# EAGLE design uCBoardBase (EAGLE 6.4)

## Sheet 1 of 2
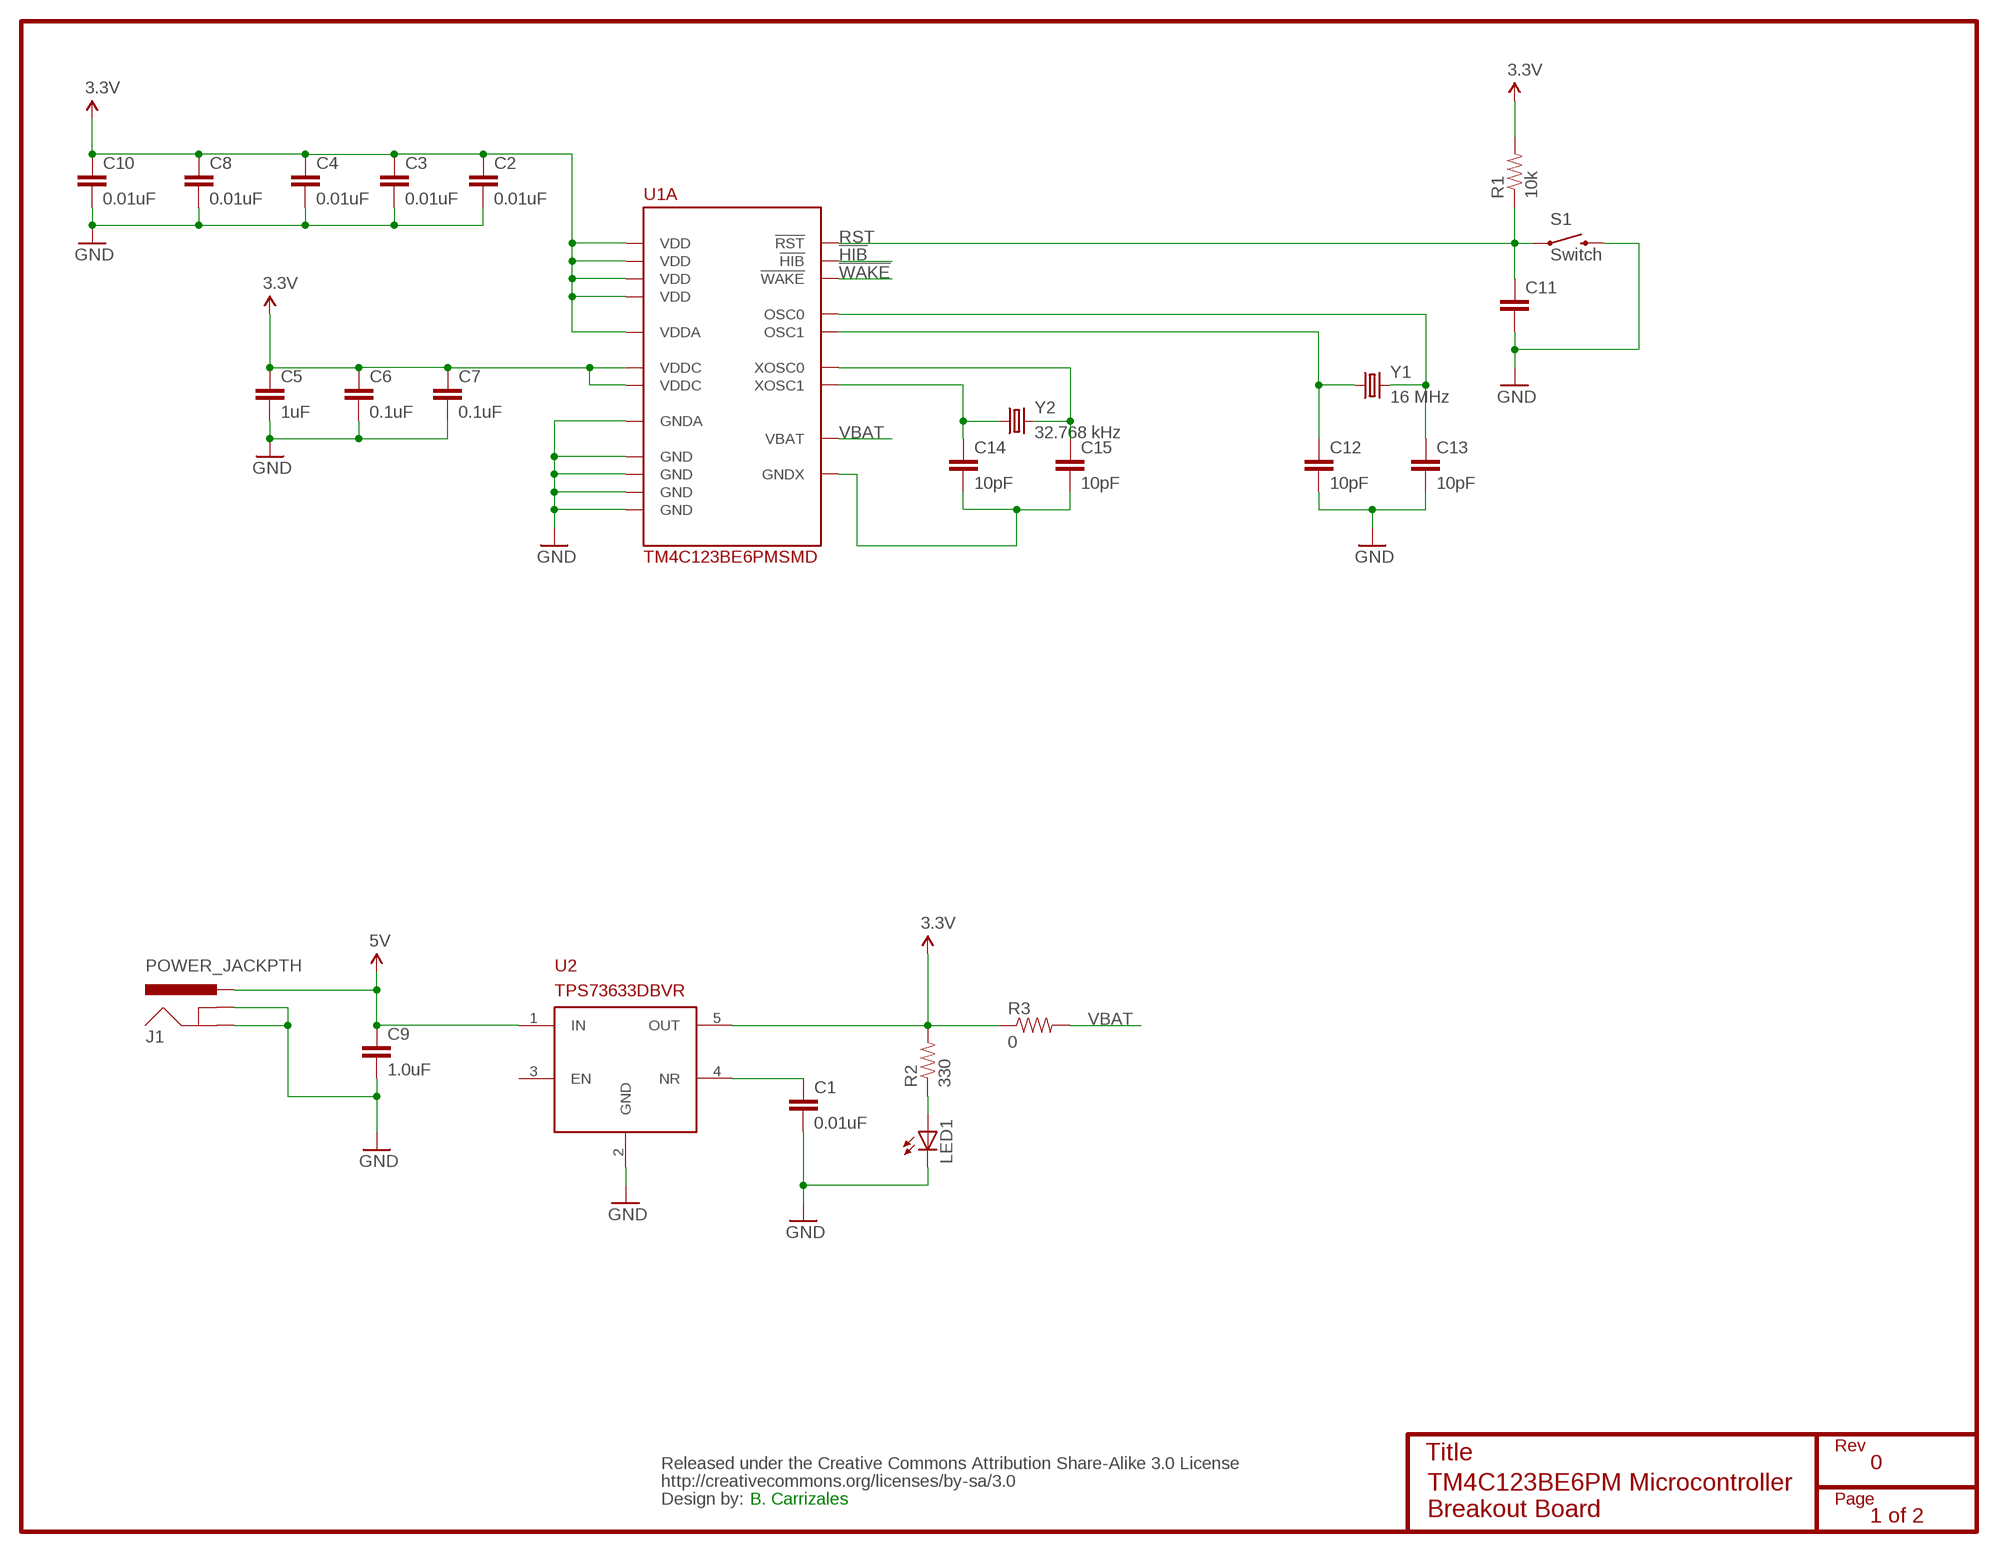
[diagram p0: schematic, sheet 1]

### Parts
C1  0.01uF  CAP0603-CAP  [0603-CAP]
C2  0.01uF  CAP0603-CAP  [0603-CAP]
C3  0.01uF  CAP0603-CAP  [0603-CAP]
C4  0.01uF  CAP0603-CAP  [0603-CAP]
C5  1uF  CAP0603-CAP  [0603-CAP]
C6  0.1uF  CAP0603-CAP  [0603-CAP]
C7  0.1uF  CAP0603-CAP  [0603-CAP]
C8  0.01uF  CAP0603-CAP  [0603-CAP]
C9  1.0uF  CAP0603-CAP  [0603-CAP]
C10  0.01uF  CAP0603-CAP  [0603-CAP]
C11  CAP0603-CAP  [0603-CAP]
C12  10pF  CAP0603-CAP  [0603-CAP]
C13  10pF  CAP0603-CAP  [0603-CAP]
C14  10pF  CAP0603-CAP  [0603-CAP]
C15  10pF  CAP0603-CAP  [0603-CAP]
CC_TEXT1  CREATIVE_COMMONS  [CREATIVE_COMMONS]
J1  POWER_JACKPTH  [POWER_JACK_PTH]
LED1  LED1206  [LED-1206]
R1  10k  RESISTOR0603-RES  [0603-RES]
R2  330  RESISTOR0603-RES  [0603-RES]
R3  0  RESISTOR0603-RES  [0603-RES]
S1  Switch  SWITCH-MOMENTARY-2-SMD-1101NE  [TACTILE-SWITCH-1101NE]
U1  TM4C123BE6PMSMD  [64LQFP]
U2  TPS73633DBVR  [SOT23-DBV]
Y1  16 MHz  CRYSTALHC49US  [HC49US]
Y2  32.768 kHz  CRYSTALTC26H  [TC26H]

### Nets
3.3V: C2.1 C3.1 C4.1 C5.1 C6.1 C7.1 C8.1 C10.1 R1.2 R2.2 R3.1 U1.2(A:VDDA) U1.11(A:VDD) U1.25(A:VDDC) U1.26(A:VDD) U1.42(A:VDD) U1.54(A:VDD) U1.56(A:VDDC) U2.5(OUT) ; also sheet 2
5V: C9.1 J1.PWR U2.1(IN) ; also sheet 2
!HIB: U1.33(A:!HIB) ; also sheet 2
!WAKE: U1.32(A:!WAKE) ; also sheet 2
GND: C1.2 C2.2 C3.2 C4.2 C5.2 C6.2 C7.2 C8.2 C9.2 C10.2 C11.2 C12.2 C13.2 J1.GND J1.GNDBREAK LED1.C S1.P$2 U1.3(A:GNDA) U1.12(A:GND) U1.27(A:GND) U1.39(A:GND) U1.55(A:GND) U2.2(GND) ; also sheet 2
N$2: C13.1 U1.40(A:OSC0) Y1.2
N$3: C12.1 U1.41(A:OSC1) Y1.1
N$6: C1.1 U2.4(NR)
N$8: LED1.A R2.1
N$9: C14.1 U1.36(A:XOSC1) Y2.1
N$10: C15.1 U1.34(A:XOSC0) Y2.2
N$11: C14.2 C15.2 U1.35(A:GNDX)
RST: C11.1 R1.1 S1.P$1 U1.38(A:!RST) ; also sheet 2
VBAT: R3.2 U1.37(A:VBAT) ; also sheet 2
Unconnected: U2.3(EN)

### Notes on the sheet
- 0
- B. Carrizales
- TM4C123BE6PM Microcontroller
  Breakout Board
- 1 of 2

## Sheet 2 of 2
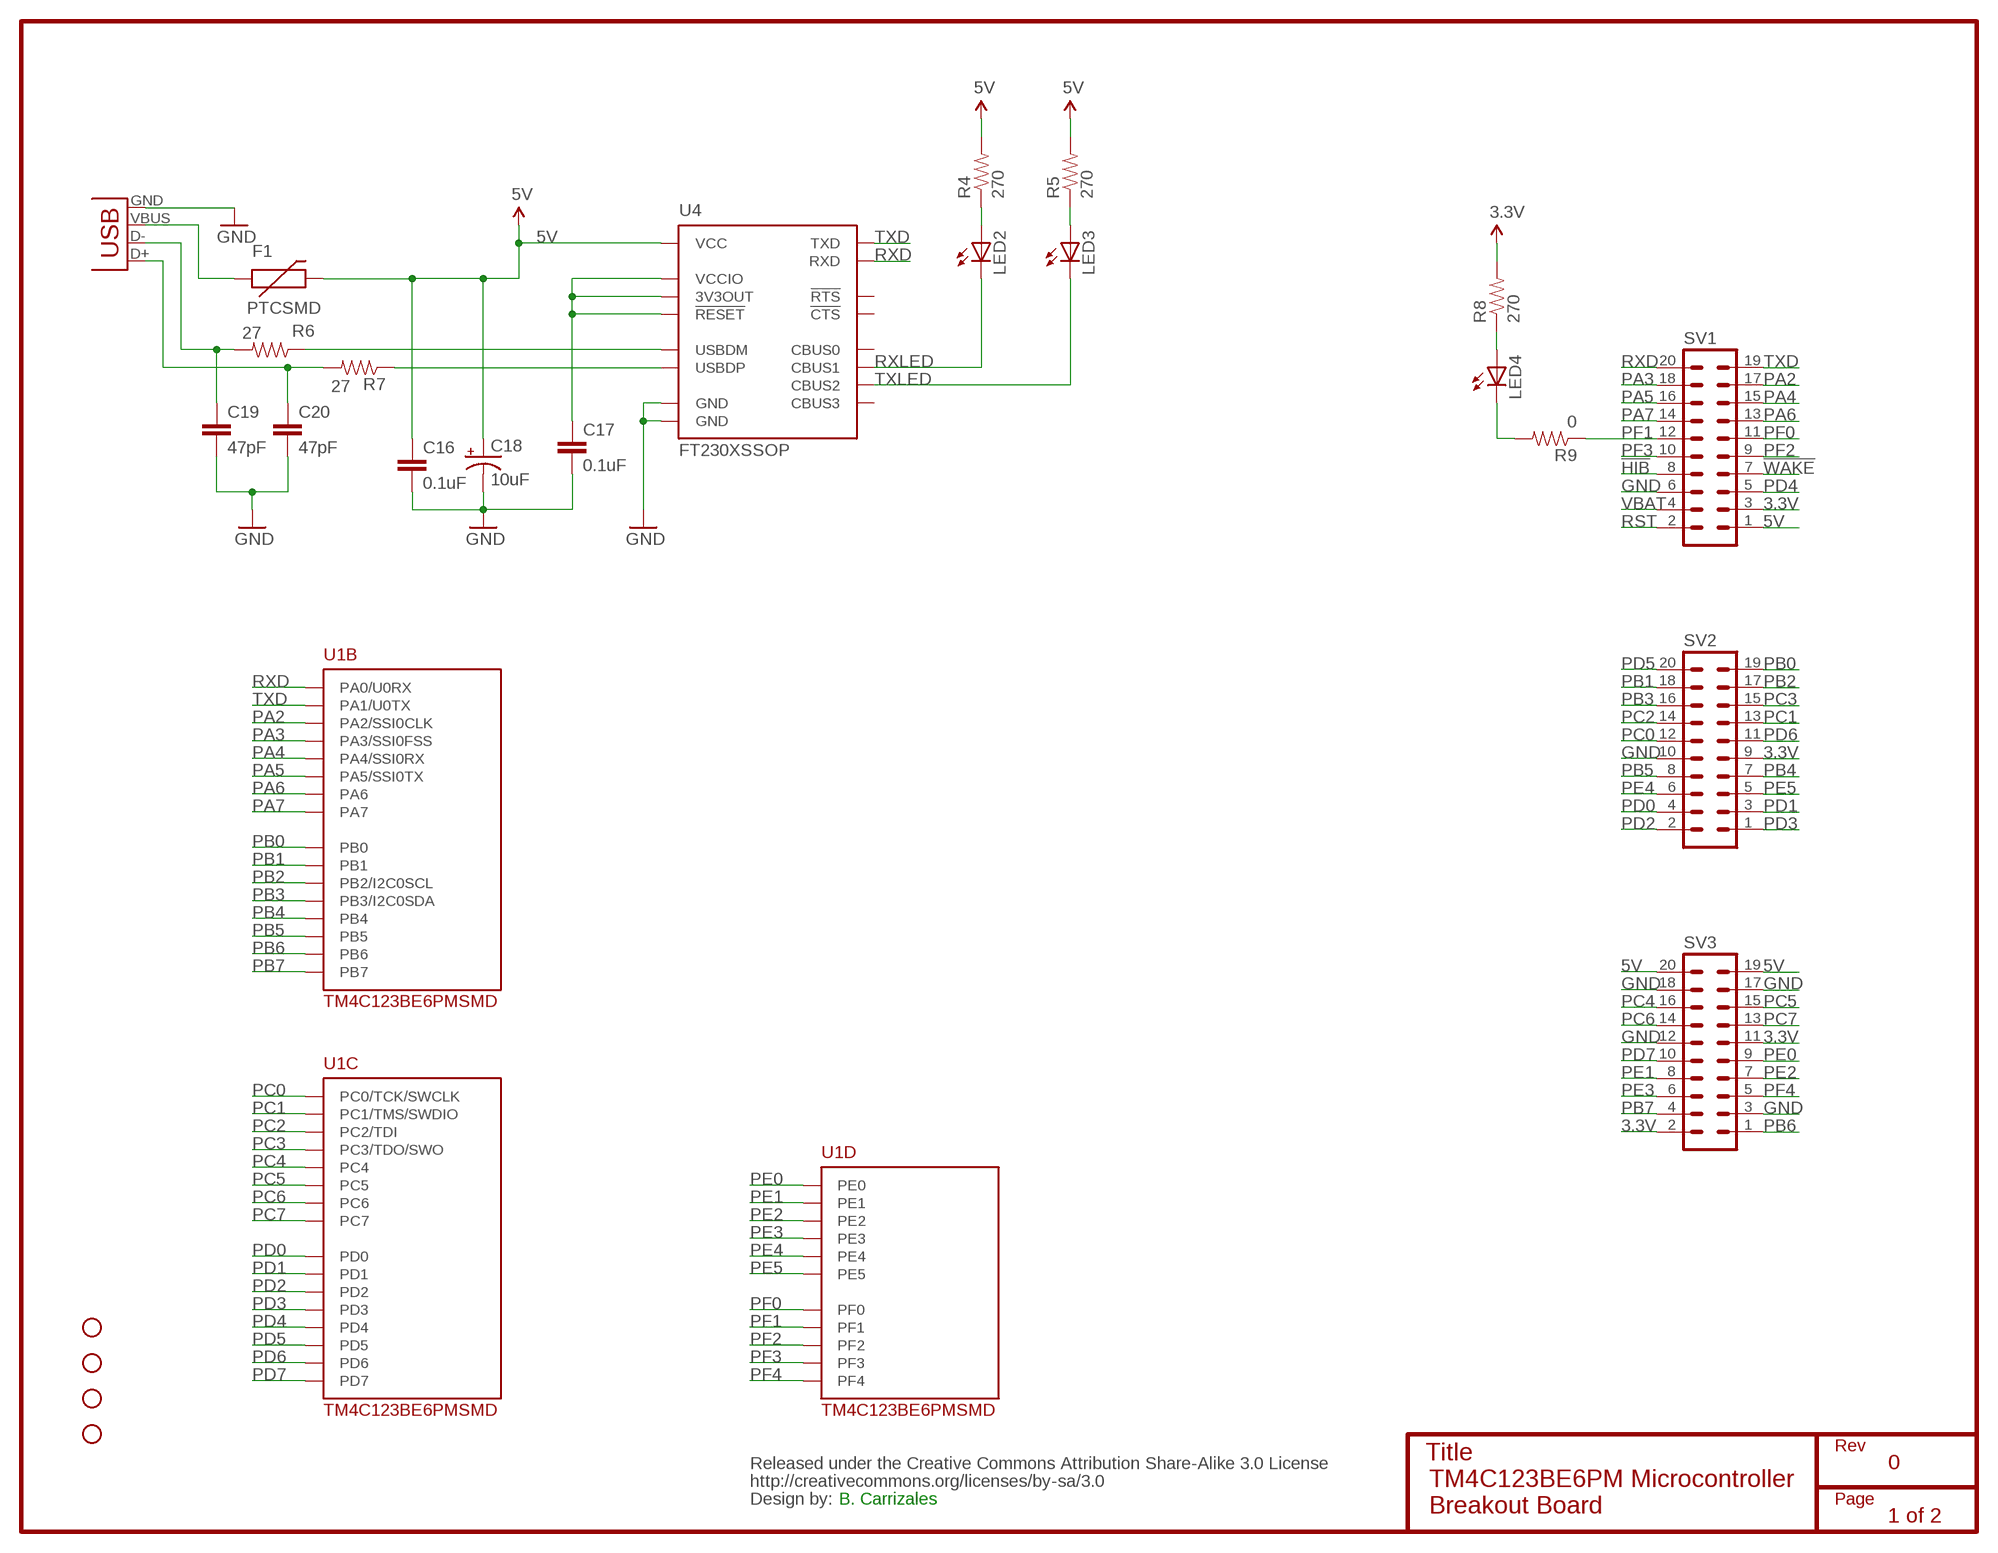
[diagram p1: schematic, sheet 2]

### Parts
C16  0.1uF  CAP0603-CAP  [0603-CAP]
C17  0.1uF  CAP0603-CAP  [0603-CAP]
C18  10uF  CAP_POL1206-KIT  [EIA3216-KIT]
C19  47pF  CAP0603-CAP  [0603-CAP]
C20  47pF  CAP0603-CAP  [0603-CAP]
CC_TEXT2  CREATIVE_COMMONS  [CREATIVE_COMMONS]
F1  PTCSMD  [PTC-1206]
JP2  USBSMD  [USB-MINIB]
LED2  LED0603  [LED-0603]
LED3  LED0603  [LED-0603]
LED4  LED0603  [LED-0603]
R4  270  RESISTOR0603-RES  [0603-RES]
R5  270  RESISTOR0603-RES  [0603-RES]
R6  27  RESISTOR0603-RES  [0603-RES]
R7  27  RESISTOR0603-RES  [0603-RES]
R8  270  RESISTOR0603-RES  [0603-RES]
R9  0  RESISTOR0603-RES  [0603-RES]
STANDOFF1  STAND-OFF  [STAND-OFF]
STANDOFF2  STAND-OFF  [STAND-OFF]
STANDOFF3  STAND-OFF  [STAND-OFF]
STANDOFF4  STAND-OFF  [STAND-OFF]
SV1  MA10-2  [MA10-2]
SV2  MA10-2  [MA10-2]
SV3  MA10-2  [MA10-2]
U4  FT230XSSOP  [SSOP16]

### Nets
3.3V: R8.2 SV1.3 SV2.9 SV3.2 SV3.11 ; also sheet 1
5V: C16.1 C18.A(+) F1.2 R4.2 R5.2 SV1.1 SV3.19 SV3.20 U4.12(VCC) ; also sheet 1
!HIB: SV1.8 ; also sheet 1
!WAKE: SV1.7 ; also sheet 1
GND: C16.2 C17.2 C18.C(-) C19.2 C20.2 JP2.GND SV1.6 SV2.10 SV3.3 SV3.12 SV3.17 SV3.18 U4.5(GND) U4.13(GND) ; also sheet 1
N$1: LED4.A R8.1
N$4: C19.1 JP2.D- R6.2
N$7: C20.1 JP2.D+ R7.2
N$12: LED3.A R5.1
N$13: LED2.A R4.1
N$14: F1.1 JP2.VBUS
N$15: R7.1 U4.8(USBDP)
N$16: R6.1 U4.9(USBDM)
N$17: C17.1 U4.3(VCCIO) U4.10(3V3OUT) U4.11(!RESET)
PA2: SV1.17 U1.19(B:PA2/SSI0CLK)
PA3: SV1.18 U1.20(B:PA3/SSI0FSS)
PA4: SV1.15 U1.21(B:PA4/SSI0RX)
PA5: SV1.16 U1.22(B:PA5/SSI0TX)
PA6: SV1.13 U1.23(B:PA6)
PA7: SV1.14 U1.24(B:PA7)
PB0: SV2.19 U1.45(B:PB0)
PB1: SV2.18 U1.46(B:PB1)
PB2: SV2.17 U1.47(B:PB2/I2C0SCL)
PB3: SV2.16 U1.48(B:PB3/I2C0SDA)
PB4: SV2.7 U1.58(B:PB4)
PB5: SV2.8 U1.57(B:PB5)
PB6: SV3.1 U1.1(B:PB6)
PB7: SV3.4 U1.4(B:PB7)
PC0: SV2.12 U1.52(C:PC0/TCK/SWCLK)
PC1: SV2.13 U1.51(C:PC1/TMS/SWDIO)
PC2: SV2.14 U1.50(C:PC2/TDI)
PC3: SV2.15 U1.49(C:PC3/TDO/SWO)
PC4: SV3.16 U1.16(C:PC4)
PC5: SV3.15 U1.15(C:PC5)
PC6: SV3.14 U1.14(C:PC6)
PC7: SV3.13 U1.13(C:PC7)
PD0: SV2.4 U1.61(C:PD0)
PD1: SV2.3 U1.62(C:PD1)
PD2: SV2.2 U1.63(C:PD2)
PD3: SV2.1 U1.64(C:PD3)
PD4: SV1.5 U1.43(C:PD4)
PD5: SV2.20 U1.44(C:PD5)
PD6: SV2.11 U1.53(C:PD6)
PD7: SV3.10 U1.10(C:PD7)
PE0: SV3.9 U1.9(D:PE0)
PE1: SV3.8 U1.8(D:PE1)
PE2: SV3.7 U1.7(D:PE2)
PE3: SV3.6 U1.6(D:PE3)
PE4: SV2.6 U1.59(D:PE4)
PE5: SV2.5 U1.60(D:PE5)
PF0: SV1.11 U1.28(D:PF0)
PF1: R9.1 SV1.12 U1.29(D:PF1)
PF2: SV1.9 U1.30(D:PF2)
PF3: SV1.10 U1.31(D:PF3)
PF4: SV3.5 U1.5(D:PF4)
RST: SV1.2 ; also sheet 1
RXD: SV1.20 U1.17(B:PA0/U0RX) U4.4(RXD)
RXLED: LED2.C U4.14(CBUS1)
TXD: SV1.19 U1.18(B:PA1/U0TX) U4.1(TXD)
TXLED: LED3.C U4.7(CBUS2)
TXLED1: LED4.C R9.2
VBAT: SV1.4 ; also sheet 1
Unconnected: U4.2(!RTS) U4.6(!CTS) U4.15(CBUS0) U4.16(CBUS3)

### Notes on the sheet
- 0
- B. Carrizales
- TM4C123BE6PM Microcontroller
  Breakout Board
- 1 of 2

## Library data of the parts
C1-C17 C19 C20 = SparkFun-Passives:CAP: Capacitor Standard 0603 ceramic capacitor, and 0.1" leaded capacitor.
C18 = SparkFun-Passives:CAP_POL: Capacitor Polarized These are standard SMD and PTH capacitors. Normally 10uF, 47uF, and 100uF in electrolytic and tantalum varieties. Always verify the external diameter of the through hole cap, it varies with capacity, voltage, and manufacturer. The EIA devices should be standard.
CC_TEXT1 CC_TEXT2 = SparkFun-Aesthetics:CREATIVE_COMMONS: Creative Commons License summary
F1 = SparkFun-PowerIC:PTC: Resettable Fuse PTC Resettable Fuse. Spark Fun Electronics SKU : COM-08357
J1 = SparkFun-Connectors:POWER_JACK: Power Jack This is the standard 5.5mm barrel jack for power. The PTH is the most common, proven, reliable, footprint. The Slot footprint only works if the mill layer is transmitted to the PCB fab house so be warned. Spark Fun Electronics SKU : PRT-00119 SMT: CONN-08106 Mating wall wart : TOL-00298 (and others)
JP2 = SparkFun-Connectors:USB: USB Connectors USB-B-PTH is fully proven SKU : PRT-00139/CONN-08278 USB-miniB is fully proven SKU : PRT-00587 USB-A-PCB is untested. USB-A-H is throughly reviewed, but untested. Spark Fun Electronics SKU : PRT-00437 USB-B-SMT is throughly reviewed, but untested. Needs silkscreen touching up. USB-A-S has not been used/tested USB-MB-H has not been used/tested USB-MICROB has been used. CONN-09505
LED1-LED4 = SparkFun-LED:LED: LEDs Standard schematic elements and footprints for 5mm, 3mm, 1206, and 0603 sized LEDs. 5mm - Spark Fun Electronics SKU : COM-00529 (and others)
R1-R9 = SparkFun-Passives:RESISTOR: Resistor Basic schematic elements and footprints for 0603, 1206, and PTH resistors.
S1 = SparkFun-Electromechanical:SWITCH-MOMENTARY-2: Various NO switches- pushbuttons, reed, etc
STANDOFF1-STANDOFF4 = SparkFun-Electromechanical:STAND-OFF: #4 Stand Off This is the mechanical footprint for a #4 phillips button head screw. Use the keepout ring to avoid running the screw head into surrounding components. SKU : PRT-00447
SV1-SV3 = con-lstb:MA10-2: PIN HEADER; OC_FARNELL: unknown; OC_NEWARK: unknown
U1 = microcontrollers-ti:TM4C123BE6PM: TM4C123BE6PM is a cortex-M microcontroller made by Texas Instruments; DIGIKEYPART#: 296-35834-ND
U2 = regulators:TPS73633DBVR; DIGIKEY#: 296-27064-1-ND
U4 = SparkFun-DigitalIC:FT230X: The FT230X is a simple USB to serial converter IC. The CBUS lines can be used as TX and RX activity LEDs, RS485 Tx data enable, and device sleep control.
Y1 Y2 = SparkFun-FreqCtrl:CRYSTAL: Various standard crystals. Proven footprints. Spark Fun Electronics SKU : COM-00534

## Board
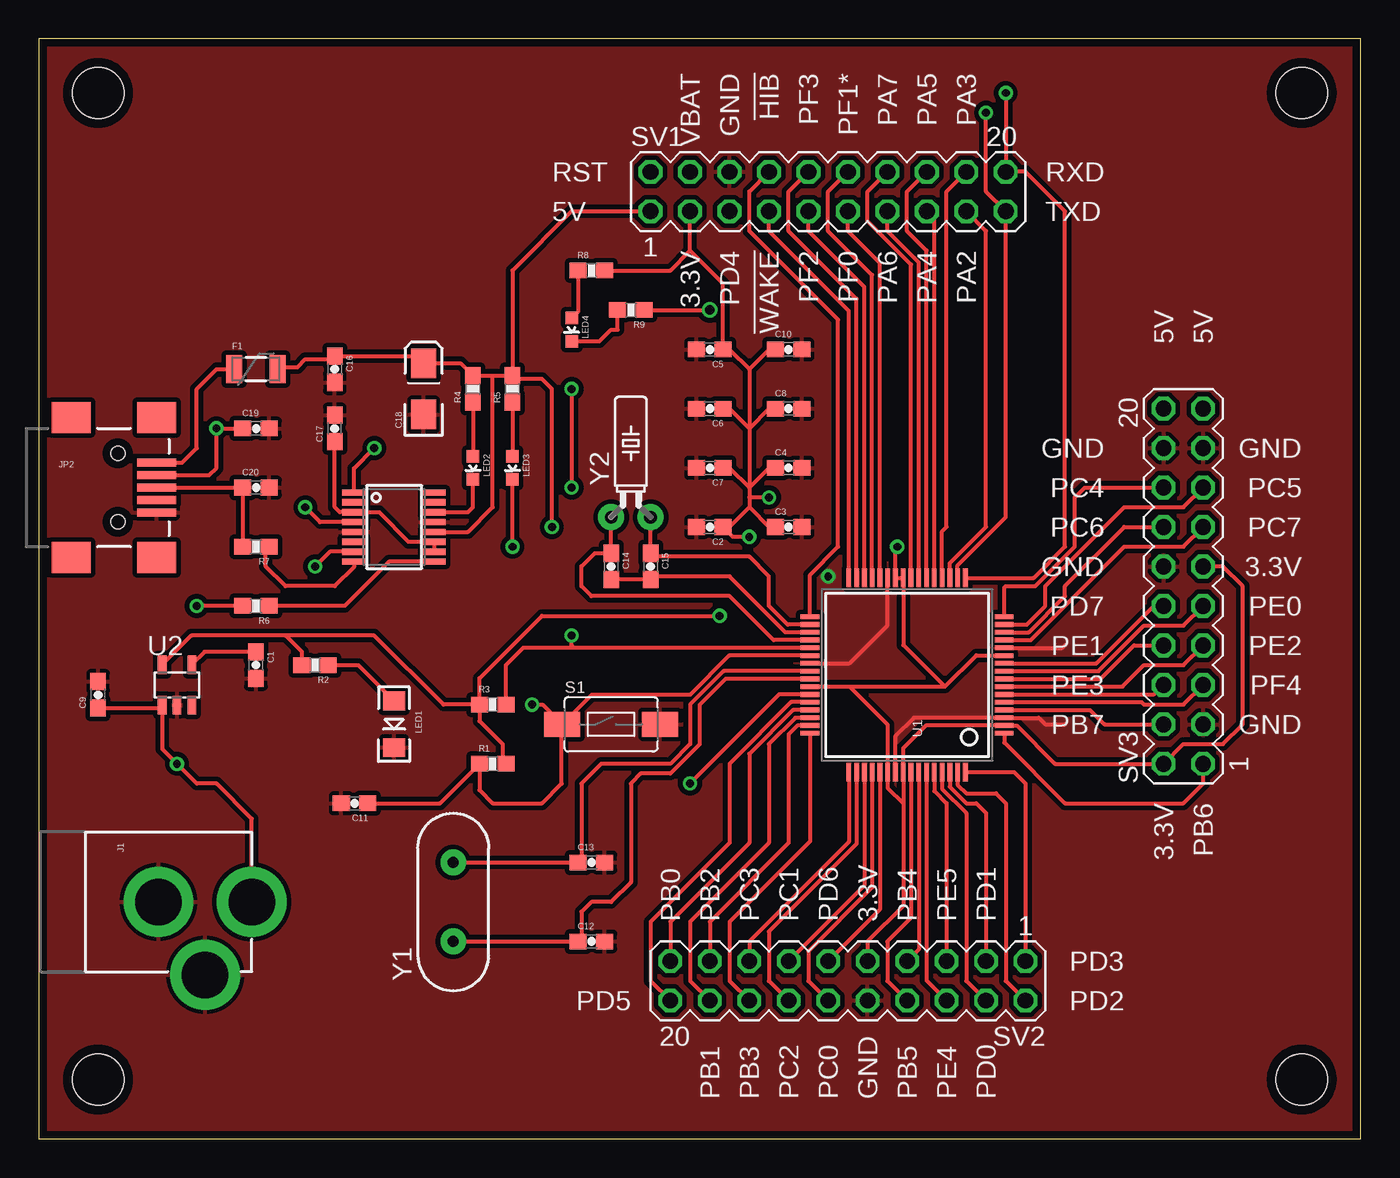
[diagram p2: board, top side]
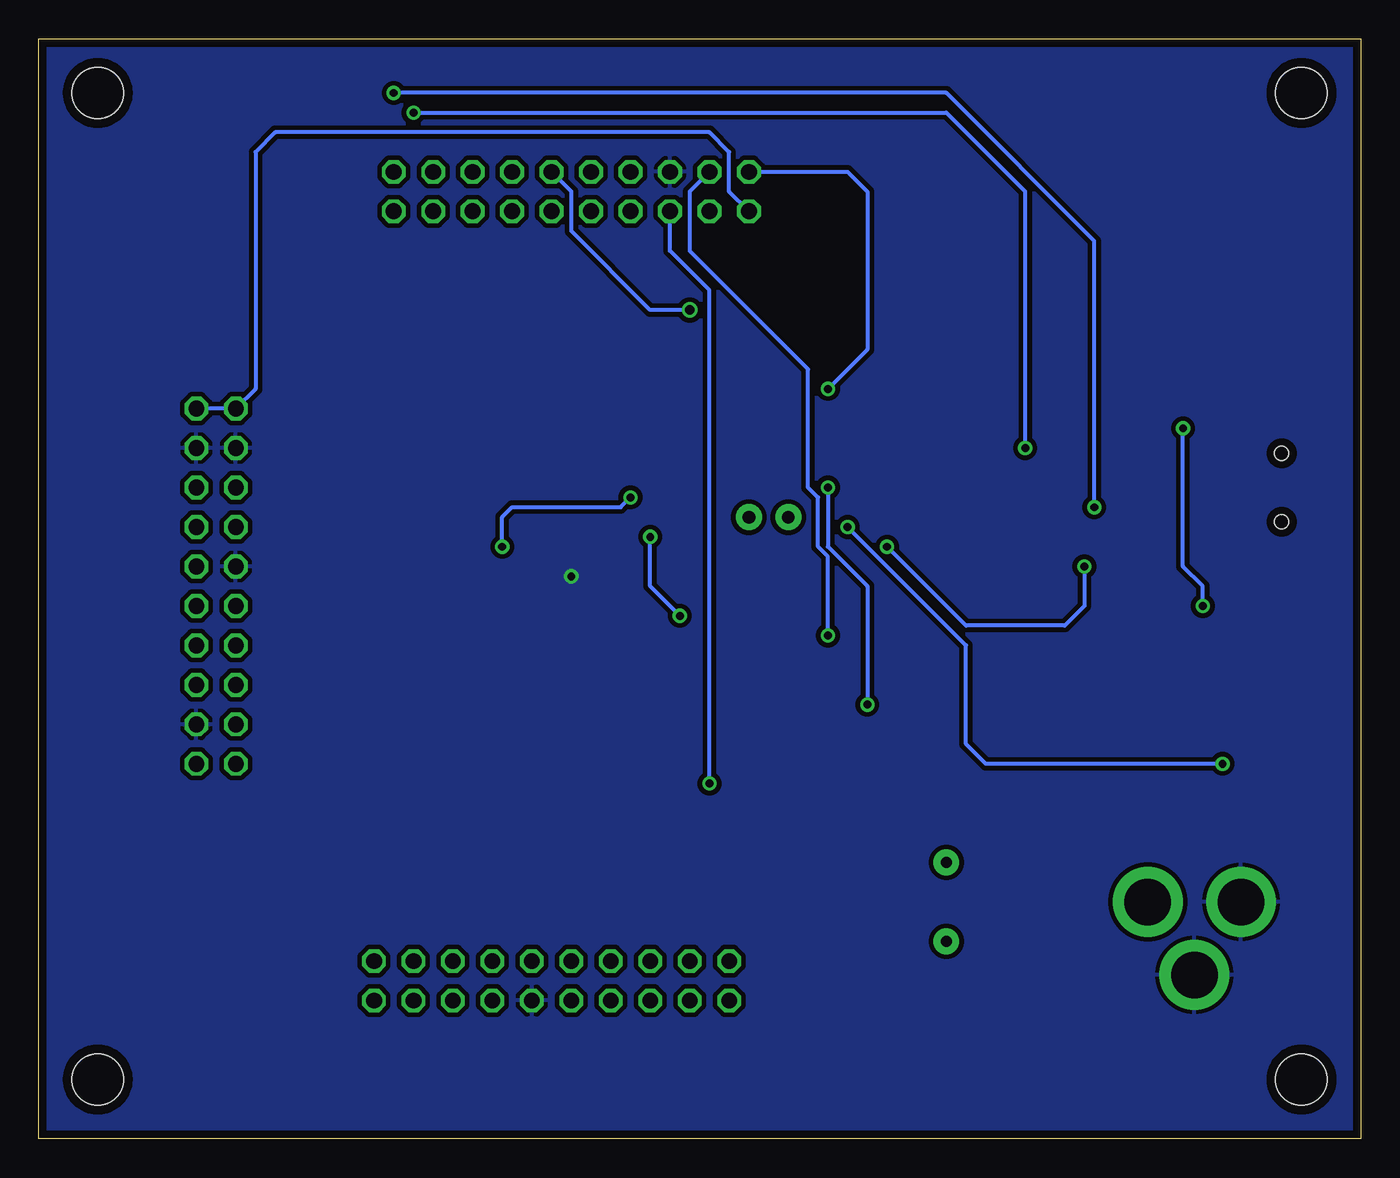
[diagram p3: board, bottom side, seen from below]

Size 85.07 x 70.79 mm. Coordinates in mm from the lower left corner, seen from the top.
Outline: 0,0 85.07,0 85.07,70.79 0,70.79 0,0
Copper layers (1*16): Top 0.0178mm / dielectric 59mil / Bottom 0.0178mm
Design rules "SSC-EAGLE-2Lyr_v1.0.0.3": minimum track width 6mil, minimum drill 14mil, track to track 6mil, track to pad 6mil, pad to pad 6mil, via to via 6mil, smd to smd 6mil, copper to edge 20mil, drill to drill 16mil, minimum pad ring 8mil, minimum via ring 8mil, stop-mask expansion 3mil, vias tented up to drill 0mil, thermal gap 10mil

### Footprints (pad centres in the part's own frame; a part is rotated, then mirrored left to right if it is on the bottom)
0603-CAP = smd 1.1 x 1: 1 -0.85,0; 2 0.85,0
EIA3216-KIT = smd 1.9 x 1.6: A 1.65,0; C -1.65,0
PTC-1206 = smd 1 x 1.8: 1 -1.4,0; 2 1.4,0
POWER_JACK_PTH = drill 2.997 pad 4.318: GND 0,7.7; GNDBREAK 4.7,10.7; PWR 0,13.7
USB-MINIB = smd 2.5 x 0.5: D+ 2.5,0; D- 2.5,0.8; GND 2.5,-1.6; ID 2.5,-0.8; VBUS 2.5,1.6 | smd 2.5 x 2: MTN1 -3,4.5; MTN2 2.5,4.5; MTN3 -3,-4.5; MTN4 2.5,-4.5 | hole 0.9: 0,2.2; 0,-2.2
LED-1206 = smd 1.2 x 1.4: A -1.5,0; C 1.5,0
LED-0603 = smd 0.8 x 0.8: A 0,-0.75; C 0,0.75
0603-RES = smd 1.1 x 1: 1 -0.85,0; 2 0.85,0
TACTILE-SWITCH-1101NE = smd 2.3 x 1.6: P$1 -3.15,0; P$2 3.15,0
STAND-OFF = hole 3.302: 0,0
MA10-2 = drill 1.016 octagon: 1 -11.43,-1.27; 2 -11.43,1.27; 3 -8.89,-1.27; 4 -8.89,1.27; 5 -6.35,-1.27; 6 -6.35,1.27; 7 -3.81,-1.27; 8 -3.81,1.27; 9 -1.27,-1.27; 10 -1.27,1.27; 11 1.27,-1.27; 12 1.27,1.27; 13 3.81,-1.27; 14 3.81,1.27; 15 6.35,-1.27; 16 6.35,1.27; 17 8.89,-1.27; 18 8.89,1.27; 19 11.43,-1.27; 20 11.43,1.27
64LQFP = smd 0.3 x 1.2: 1 -3.75,-6.25; 2 -3.25,-6.25; 3 -2.75,-6.25; 4 -2.25,-6.25; 5 -1.75,-6.25; 6 -1.25,-6.25; 7 -0.75,-6.25; 8 -0.25,-6.25; 9 0.25,-6.25; 10 0.75,-6.25; 11 1.25,-6.25; 12 1.75,-6.25; 13 2.25,-6.25; 14 2.75,-6.25; 15 3.25,-6.25; 16 3.75,-6.25; 33 3.75,6.25; 34 3.25,6.25; 35 2.75,6.25; 36 2.25,6.25; 37 1.75,6.25; 38 1.25,6.25; 39 0.75,6.25; 40 0.25,6.25; 41 -0.25,6.25; 42 -0.75,6.25; 43 -1.25,6.25; 44 -1.75,6.25; 45 -2.25,6.25; 46 -2.75,6.25; 47 -3.25,6.25; 48 -3.75,6.25 | smd 1.2 x 0.3: 17 6.25,-3.75; 18 6.25,-3.25; 19 6.25,-2.75; 20 6.25,-2.25; 21 6.25,-1.75; 22 6.25,-1.25; 23 6.25,-0.75; 24 6.25,-0.25; 25 6.25,0.25; 26 6.25,0.75; 27 6.25,1.25; 28 6.25,1.75; 29 6.25,2.25; 30 6.25,2.75; 31 6.25,3.25; 32 6.25,3.75; 49 -6.25,3.75; 50 -6.25,3.25; 51 -6.25,2.75; 52 -6.25,2.25; 53 -6.25,1.75; 54 -6.25,1.25; 55 -6.25,0.75; 56 -6.25,0.25; 57 -6.25,-0.25; 58 -6.25,-0.75; 59 -6.25,-1.25; 60 -6.25,-1.75; 61 -6.25,-2.25; 62 -6.25,-2.75; 63 -6.25,-3.25; 64 -6.25,-3.75
SOT23-DBV = smd 0.55 x 1.2: 1 -0.95,-1.3; 2 0,-1.3; 3 0.95,-1.3; 4 0.95,1.3; 5 -0.95,1.3
SSOP16 = smd 0.4 x 1.5: 1 -2.223,-2.578; 2 -1.587,-2.578; 3 -0.953,-2.578; 4 -0.318,-2.578; 5 0.318,-2.578; 6 0.953,-2.578; 7 1.587,-2.578; 8 2.223,-2.578; 9 2.223,2.578; 10 1.587,2.578; 11 0.953,2.578; 12 0.318,2.578; 13 -0.318,2.578; 14 -0.953,2.578; 15 -1.587,2.578; 16 -2.223,2.578
HC49US = drill 0.7 pad 1.651: 1 -2.54,0; 2 2.54,0
TC26H = drill 0.813 pad 1.676: 1 -1.27,0; 2 1.27,0

### Placement (x,y rotation side)
C1  13.97,30.48 270 top
C2  43.18,39.37 180 top
C3  48.26,39.37 0 top
C4  48.26,43.18 0 top
C5  43.18,50.8 180 top
C6  43.18,46.99 180 top
C7  43.18,43.18 180 top
C8  48.26,46.99 0 top
C9  3.81,28.57 90 top
C10  48.26,50.8 0 top
C11  20.32,21.59 180 top
C12  35.56,12.7 0 top
C13  35.56,17.78 0 top
C14  36.83,36.83 270 top
C15  39.37,36.83 270 top
C16  19.05,49.53 270 top
C17  19.05,45.72 90 top
C18  24.77,48.26 90 top
C19  13.97,45.72 0 top
C20  13.97,41.91 0 top
CC_TEXT1  20.32,-7.62 0 top  (outside the outline)
CC_TEXT2  20.32,-7.62 0 top  (outside the outline)
F1  13.97,49.53 0 top
J1  0,15.24 270 top
JP2  5.08,41.91 0 top
LED1  22.86,26.67 270 top
LED2  27.94,43.18 180 top
LED3  30.48,43.18 180 top
LED4  34.29,52.07 180 top
R1  29.21,24.13 0 top
R2  17.78,30.48 180 top
R3  29.21,27.94 0 top
R4  27.94,48.26 90 top
R5  30.48,48.26 90 top
R6  13.97,34.29 180 top
R7  13.97,38.1 180 top
R8  35.56,55.88 0 top
R9  38.1,53.34 180 top
S1  36.83,26.67 0 top
STANDOFF1  81.28,3.81 0 top
STANDOFF2  81.28,67.31 0 top
STANDOFF3  3.81,67.31 0 top
STANDOFF4  3.81,3.81 0 top
SV1  50.8,60.96 0 top
SV2  52.07,10.16 180 top
SV3  73.66,35.56 90 top
U1  55.88,29.84 90 top
U2  8.89,29.21 0 top
U4  22.86,39.37 270 top
Y1  26.67,15.24 90 top
Y2  38.1,40.01 0 top

### Tracks (layer width: path | path; a pad name or v marks a point on that pad's centre or on a via)
3.3V  (via drill 0.51)
  Top 0.254: C10.1 46.99,50.8 45.72,49.53 | 45.72,49.53 45.72,45.72 | 45.72,45.72 45.72,41.91 | 45.72,41.91 45.72,41.27 | 45.72,41.27 45.72,40.64 | 45.72,40.64 46.99,39.37 C3.1 | C4.1 46.99,43.18 45.72,41.91 | C8.1 46.99,46.99 45.72,45.72 | 45.72,49.53 44.45,50.8 C5.1 44.03,55.03 41.91,57.15 | C6.1 44.45,46.99 45.72,45.72 | C7.1 44.45,43.18 45.72,41.91 | 45.72,40.64 44.45,39.37 C2.1 44.66,38.73 v45.72,38.73 | R2.2 16.93,31.33 15.88,32.38 | 15.88,32.38 9.81,32.38 U2.5 | R3.1 27.94,27.94 | 15.88,32.38 21.59,32.38 26.04,27.94 R3.1 | 55.63,21.59 U1.56 55.63,25.15 57.08,26.59 U1.2 62.94,26.59 65.41,24.13 SV3.2 73.66,25.4 76.2,25.4 77.47,26.67 77.47,35.56 76.2,36.83 SV3.11 | 55.63,21.59 55.63,14.99 53.34,12.7 SV2.9 | 55.63,21.59 54.63,22.59 U1.54 54.61,23.61 54.61,26.67 52.19,29.09 | U1.42 52.19,29.09 | 52.19,29.09 58.3,29.09 | 58.3,29.09 60.33,31.11 62.11,31.11 U1.11 | 58.3,29.09 55.63,31.77 U1.25 U1.26 55.13,37.98 v55.24,38.1 | v46.99,41.27 45.72,41.27 | R3.1 28.36,26.89 29.84,25.4 29.84,24.34 R1.2 | R3.1 28.36,29.63 32.38,33.66 v43.81,33.66 | 41.91,57.15 SV1.3 | R8.2 40.64,55.88 41.91,57.15
  Bottom 0.254: v55.24,38.1 55.24,40.01 54.61,40.64 47.62,40.64 v46.99,41.27 | v43.81,33.66 45.72,35.56 v45.72,38.73
5V  (via drill 0.51)
  Top 0.254: 24.6,49.74 C18.A | C18.A 27.14,49.91 R4.2 29.21,49.11 | 29.21,49.11 R5.2 | U4.12 27.62,39.05 29.21,40.64 29.21,49.11 | F1.2 15.37,49.66 16.64,49.66 17.14,50.16 18.84,50.16 C16.1 24.3,50.38 C18.A | C9.1 7.75,27.73 U2.1 7.94,25.08 v8.89,24.13 10.16,22.86 11.43,22.86 13.7,20.59 J1.PWR | v33.02,39.37 33.02,48.26 32.38,48.9 30.7,48.9 R5.2 | SV1.1 34.29,59.69 30.48,55.88 R5.2
  Bottom 0.254: v8.89,24.13 24.13,24.13 25.4,25.4 25.4,31.75 v33.02,39.37 | SV1.1 40.64,60.96 40.64,63.5 41.91,64.77 69.85,64.77 71.12,63.5 71.12,48.26 SV3.20 SV3.19
!HIB
  Top 0.254: U1.33 49.63,36.3 51.44,38.1 51.44,52.7 45.72,58.42 45.72,60.96 SV1.8
!WAKE
  Top 0.254: U1.32 52.13,53.28 46.99,58.42 SV1.7
GND  (via drill 0.51)
  Top 0.254: U1.39 52.19,30.59 54.61,33.02 54.61,36.08 U1.27 | U1.55 55.13,25.92 56.3,27.09 U1.3 64.34,27.09 64.77,26.67 66.04,26.67 | U1.12 65.89,31.59 66.04,31.75
  other vias: 50.8,36.2
  pour Top (isolate 0.305): 0,72.39 0,0 85.09,0 85.09,72.39
  pour Bottom (isolate 0.305): 0,72.39 0,0 85.09,0 85.09,72.39
N$1
  Top 0.254: R8.1 34.71,53.24 LED4.A
N$2
  Top 0.254: Y1.2 C13.1 34.92,18 34.92,22.86 36.2,24.13 40.64,24.13 41.91,25.4 41.91,27.94 44.06,30.09 U1.40
N$3
  Top 0.254: Y1.1 C12.1 34.92,12.91 34.92,14.61 35.56,15.24 36.83,15.24 38.1,16.51 38.1,22.86 38.73,23.5 40.64,23.5 42.55,25.4 42.55,27.94 44.2,29.59 U1.41
N$4  (via drill 0.51)
  Top 0.254: R6.2 v10.16,34.29 | C19.1 v11.43,45.72 11.43,43.18 10.96,42.71 JP2.D-
  Bottom 0.254: v10.16,34.29 10.16,35.56 11.43,36.83 v11.43,45.72
N$6
  Top 0.254: C1.1 10.66,31.33 U2.4
N$7
  Top 0.254: JP2.D+ C20.1 R7.2
N$8
  Top 0.254: R2.1 20.55,30.48 LED1.A
N$9
  Top 0.254: Y2.1 C14.1 35.77,37.68 34.92,36.83 34.92,35.56 35.56,34.92 44.45,34.92 47.28,32.09 U1.36
N$10
  Top 0.254: Y2.2 C15.1 39.59,37.47 45.72,37.47 46.99,36.2 46.99,34.29 48.19,33.09 U1.34
N$11
  Top 0.254: C14.2 C15.2 39.59,36.2 44.45,36.2 48.05,32.59 U1.35
N$12
  Top 0.254: R5.1 LED3.A
N$13
  Top 0.254: R4.1 LED2.A
N$14
  Top 0.254: JP2.VBUS 9.22,43.51 10.16,44.45 10.16,48.26 11.43,49.53 F1.1
N$15
  Top 0.254: U4.8 20.28,36.79 19.05,35.56 15.88,35.56 14.61,36.83 14.61,37.88 R7.1
N$16
  Top 0.254: U4.9 22.54,37.15 19.68,34.29 R6.1
N$17
  Top 0.254: U4.10 U4.11 23.81,38.42 21.91,40.32 U4.3 19.37,40.32 19.05,40.64 C17.1
PA2
  Top 0.254: U1.19 58.63,37.04 60.96,39.37 60.96,58.42 SV1.17
PA3
  Top 0.254: U1.20 58.13,39.08 58.42,39.37 58.42,60.96 SV1.18
PA4
  Top 0.254: U1.21 57.63,59.21 SV1.15
PA5
  Top 0.254: U1.22 57.13,57.17 55.88,58.42 55.88,60.96 SV1.16
PA6
  Top 0.254: U1.23 56.63,56.4 54.61,58.42 SV1.13
PA7
  Top 0.254: U1.24 56.13,56.27 53.34,59.05 53.34,60.96 SV1.14
PB0
  Top 0.254: U1.45 48.55,27.59 45.72,24.77 45.72,19.05 40.64,13.97 SV2.19
PB1
  Top 0.254: U1.46 48.69,27.09 46.99,25.4 46.99,19.05 41.91,13.97 41.91,10.16 SV2.18
PB2
  Top 0.254: U1.47 48.82,26.59 48.26,26.04 48.26,19.05 43.18,13.97 SV2.17
PB3
  Top 0.254: U1.48 49.63,19.15 44.45,13.97 44.45,10.16 SV2.16
PB4
  Top 0.254: U1.58 56.63,12.18 SV2.7
PB5
  Top 0.254: U1.57 56.13,14.22 54.61,12.7 54.61,10.16 SV2.8
PB6
  Top 0.254: U1.1 62.13,25.5 66.04,21.59 73.66,21.59 74.93,22.86 SV3.1
PB7
  Top 0.254: SV3.4 68.58,26.67 67.66,27.59 U1.4
PC0
  Top 0.254: U1.52 53.63,16.16 49.53,12.06 49.53,10.16 SV2.12
PC1
  Top 0.254: U1.51 53.13,16.3 SV2.13
PC2
  Top 0.254: U1.50 52.63,18.98 46.99,13.34 46.99,10.16 SV2.14
PC3
  Top 0.254: U1.49 52.13,19.11 45.72,12.7 SV2.15
PC4
  Top 0.254: U1.16 62.13,35.46 62.23,35.56 64.14,35.56 66.67,38.1 66.67,41.27 67.31,41.91 SV3.16
PC5
  Top 0.254: U1.15 63.58,33.09 64.77,34.29 64.77,35.56 69.85,40.64 73.66,40.64 SV3.15
PC6
  Top 0.254: U1.14 63.71,32.59 66.04,34.92 66.04,35.56 69.85,39.37 SV3.14
PC7
  Top 0.254: U1.13 63.84,32.09 69.85,38.1 73.66,38.1 SV3.13
PD0
  Top 0.254: U1.61 58.13,22.52 59.69,20.95 59.69,10.16 SV2.4
PD1
  Top 0.254: U1.62 58.63,22.65 59.69,21.59 60.33,21.59 60.96,20.95 SV2.3
PD2
  Top 0.254: U1.63 59.13,22.79 59.69,22.23 61.59,22.23 62.23,21.59 62.23,10.16 SV2.2
PD3
  Top 0.254: U1.64 62.77,23.59 63.5,22.86 SV2.1
PD4  (via drill 0.51)
  Top 0.254: U1.43 47.65,28.59 v41.91,22.86
  Bottom 0.254: v41.91,22.86 41.91,54.61 44.45,57.15 SV1.5
PD5
  Top 0.254: U1.44 48.41,28.09 44.45,24.13 44.45,19.05 39.37,13.97 39.37,10.16 SV2.20
PD6
  Top 0.254: U1.53 54.13,14.76 SV2.11
PD7
  Top 0.254: U1.10 68.06,30.59 71.75,34.29 SV3.10
PE0
  Top 0.254: U1.9 68.19,30.09 71.12,33.02 73.66,33.02 SV3.9
PE1
  Top 0.254: U1.8 68.33,29.59 70.48,31.75 SV3.8
PE2
  Top 0.254: U1.7 69.73,29.09 71.12,30.48 73.66,30.48 SV3.7
PE3
  Top 0.254: U1.6 71.78,28.59 SV3.6
PE4
  Top 0.254: U1.59 57.13,10.18 SV2.6
PE5
  Top 0.254: U1.60 57.63,22.38 58.42,21.59 SV2.5
PF0
  Top 0.254: U1.28 54.13,56.36 52.07,58.42 SV1.11
PF1  (via drill 0.6)
  Top 0.254: U1.29 53.63,55.59 50.8,58.42 50.8,60.96 SV1.12 | R9.1 v43.18,53.34
  Bottom 0.254: v43.18,53.34 45.72,53.34 50.8,58.42 50.8,60.96 SV1.12
PF2
  Top 0.254: U1.30 53.13,54.82 49.53,58.42 SV1.9
PF3
  Top 0.254: U1.31 52.63,54.05 48.26,58.42 48.26,60.96 SV1.10
PF4
  Top 0.254: U1.5 70.97,28.09 71.12,27.94 73.66,27.94 SV3.5
RST  (via drill 0.51)
  Top 0.254: C11.1 25.82,21.59 R1.1 28.36,22.44 29.21,21.59 32.38,21.59 33.66,22.86 33.66,26.64 S1.P$1 | U1.38 44.43,31.09 41.91,28.57 35.59,28.57 S1.P$1 | v34.29,48.26 v34.29,41.91 | v31.75,27.94 32.41,27.94 S1.P$1
  Bottom 0.254: SV1.2 33.02,62.23 31.75,60.96 31.75,50.8 v34.29,48.26 | v34.29,41.91 34.29,38.1 31.75,35.56 v31.75,27.94
RXD  (via drill 0.51)
  Top 0.254: U1.17 64.03,36.09 66.04,38.1 66.04,59.69 63.5,62.23 SV1.20 v62.23,67.31 | U4.4 18.1,39.69 v17.14,40.64
  Bottom 0.254: v17.14,40.64 17.14,57.78 26.67,67.31 v62.23,67.31
RXLED
  Top 0.254: U4.14 27.62,40.32 27.94,40.64 LED2.C
TXD  (via drill 0.51)
  Top 0.254: U1.18 59.13,36.91 62.23,40.01 SV1.19 60.96,60.96 v60.96,66.04 | U4.1 20.28,43.14 v21.59,44.45
  Bottom 0.254: v21.59,44.45 21.59,60.96 26.67,66.04 v60.96,66.04
TXLED  (via drill 0.51)
  Top 0.254: U4.7 18.73,37.78 v17.78,36.83 | v30.48,38.1 LED3.C
  Bottom 0.254: v17.78,36.83 17.78,34.29 19.05,33.02 25.4,33.02 v30.48,38.1
TXLED1
  Top 0.254: LED4.C 36.08,51.32 36.83,52.07 37.25,52.07 R9.2
VBAT  (via drill 0.51)
  Top 0.254: R3.2 30.06,30.48 31.18,31.59 U1.37 34.45,31.59 34.29,31.75 v34.29,32.38
  Bottom 0.254: v34.29,32.38 34.29,37.47 34.92,38.1 34.92,41.27 35.56,41.91 35.56,49.53 43.18,57.15 43.18,60.96 SV1.4

### Text on the board
tPlace: VBAT | GND | !HIB | PF3 | PF1* | PA7 | PA5 | PA3 | RST | RXD | 5V | TXD | 3.3V | PD4 | !WAKE | PF2 | PF0 | PA6 | PA4 | PA2 | 5V | 5V | GND | GND | PC4 | PC5 | PC6 | PC7 | GND | 3.3V | PD7 | PE0 | PE1 | PE2 | PE3 | PF4 | PB7 | GND | 3.3V | PB6 | PB0 | PB2 | PC3 | PC1 | PD6 | 3.3V | PB4 | PE5 | PD1 | PD3 | PD5 | PD2 | PB1 | PB3 | PC2 | PC0 | GND | PB5 | PE4 | PD0
tDocu: B. Carrizales